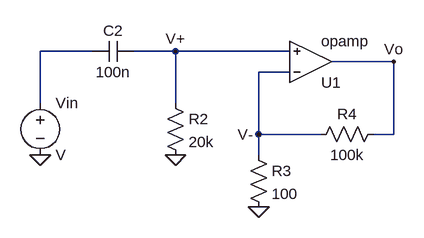
[diagram p0: schematic Spice1_2.asc]
Spice1_2.asc, the LTspice schematic file:
Version 4
SHEET 1 880 680
WIRE -64 144 -144 144
WIRE 64 144 0 144
WIRE 240 144 64 144
WIRE 400 160 304 160
WIRE 240 176 192 176
WIRE -144 224 -144 144
WIRE 64 224 64 144
WIRE 192 272 192 176
WIRE 288 272 192 272
WIRE 400 272 400 160
WIRE 400 272 368 272
WIRE 192 304 192 272
FLAG -144 304 0
FLAG 64 304 0
FLAG 192 384 0
FLAG 64 144 V+
FLAG 192 272 V-
FLAG 400 160 Vo
SYMBOL OpAmps\\opamp 272 224 M180
SYMATTR InstName U1
SYMBOL cap 0 128 R90
WINDOW 0 0 32 VBottom 2
WINDOW 3 32 32 VTop 2
SYMATTR InstName C2
SYMATTR Value 100n
SYMBOL voltage -144 208 R0
SYMATTR InstName Vin
SYMBOL res 48 208 R0
SYMATTR InstName R2
SYMATTR Value 20k
SYMBOL res 176 288 R0
SYMATTR InstName R3
SYMATTR Value 100
SYMBOL res 384 256 R90
WINDOW 0 0 56 VBottom 2
WINDOW 3 32 56 VTop 2
SYMATTR InstName R4
SYMATTR Value 100k

The netlist it stands for:
* Spice1_2.asc
XU1 V- V+ Vo opamp Aol=100K GBW=10Meg  ; pins invin noninvin out
C2 V+ N001 100n
Vin N001 0 V
R2 V+ 0 20k
R3 V- 0 100
R4 Vo V- 100k
.backanno
.end